# Altium project iF11L.PrjPcb
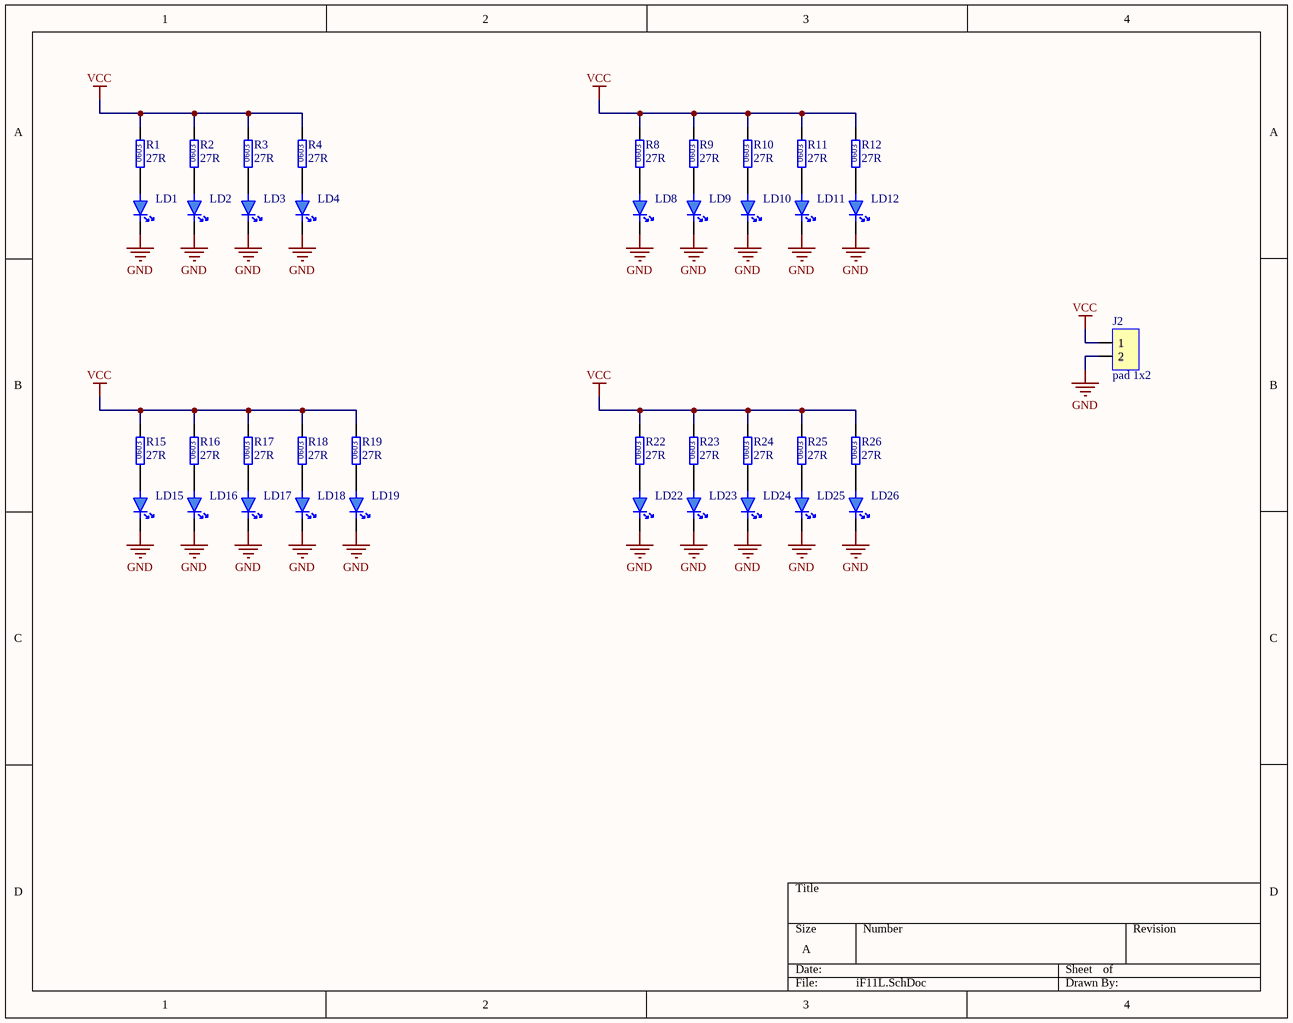
[diagram p0: iF11L.SchDoc]
1 sheet, 39 parts. Net scope: global (net labels, ports and power ports of the same name join across sheets).
Board file: iF11L.PcbDoc

## Sheet iF11L.SchDoc
size A; SheetNumber: 1; SheetTotal: 1

### Parts
J2  pad 1x2  [Pad-1x2]
LD1  HQ19-2101UWCE2 0603  [LED-0603-WS]  (value not drawn)
LD2  HQ19-2101UWCE2 0603  [LED-0603-WS]  (value not drawn)
LD3  HQ19-2101UWCE2 0603  [LED-0603-WS]  (value not drawn)
LD4  HQ19-2101UWCE2 0603  [LED-0603-WS]  (value not drawn)
LD8  HQ19-2101UWCE2 0603  [LED-0603-WS]  (value not drawn)
LD9  HQ19-2101UWCE2 0603  [LED-0603-WS]  (value not drawn)
LD10  HQ19-2101UWCE2 0603  [LED-0603-WS]  (value not drawn)
LD11  HQ19-2101UWCE2 0603  [LED-0603-WS]  (value not drawn)
LD12  HQ19-2101UWCE2 0603  [LED-0603-WS]  (value not drawn)
LD15  HQ19-2101UWCE2 0603  [LED-0603-WS]  (value not drawn)
LD16  HQ19-2101UWCE2 0603  [LED-0603-WS]  (value not drawn)
LD17  HQ19-2101UWCE2 0603  [LED-0603-WS]  (value not drawn)
LD18  HQ19-2101UWCE2 0603  [LED-0603-WS]  (value not drawn)
LD19  HQ19-2101UWCE2 0603  [LED-0603-WS]  (value not drawn)
LD22  HQ19-2101UWCE2 0603  [LED-0603-WS]  (value not drawn)
LD23  HQ19-2101UWCE2 0603  [LED-0603-WS]  (value not drawn)
LD24  HQ19-2101UWCE2 0603  [LED-0603-WS]  (value not drawn)
LD25  HQ19-2101UWCE2 0603  [LED-0603-WS]  (value not drawn)
LD26  HQ19-2101UWCE2 0603  [LED-0603-WS]  (value not drawn)
R1  27R  [R0603-LD]
R2  27R  [R0603-LD]
R3  27R  [R0603-LD]
R4  27R  [R0603-LD]
R8  27R  [R0603-LD]
R9  27R  [R0603-LD]
R10  27R  [R0603-LD]
R11  27R  [R0603-LD]
R12  27R  [R0603-LD]
R15  27R  [R0603-LD]
R16  27R  [R0603-LD]
R17  27R  [R0603-LD]
R18  27R  [R0603-LD]
R19  27R  [R0603-LD]
R22  27R  [R0603-LD]
R23  27R  [R0603-LD]
R24  27R  [R0603-LD]
R25  27R  [R0603-LD]
R26  27R  [R0603-LD]

### Nets
GND: J2.2 LD1.2(K) LD2.2(K) LD3.2(K) LD4.2(K) LD8.2(K) LD9.2(K) LD10.2(K) LD11.2(K) LD12.2(K) LD15.2(K) LD16.2(K) LD17.2(K) LD18.2(K) LD19.2(K) LD22.2(K) LD23.2(K) LD24.2(K) LD25.2(K) LD26.2(K)
VCC: J2.1 R1.2 R2.2 R3.2 R4.2 R8.2 R9.2 R10.2 R11.2 R12.2 R15.2 R16.2 R17.2 R18.2 R19.2 R22.2 R23.2 R24.2 R25.2 R26.2
NetLD1_1: LD1.1(A) R1.1
NetLD2_1: LD2.1(A) R2.1
NetLD3_1: LD3.1(A) R3.1
NetLD4_1: LD4.1(A) R4.1
NetLD8_1: LD8.1(A) R8.1
NetLD9_1: LD9.1(A) R9.1
NetLD10_1: LD10.1(A) R10.1
NetLD11_1: LD11.1(A) R11.1
NetLD12_1: LD12.1(A) R12.1
NetLD15_1: LD15.1(A) R15.1
NetLD16_1: LD16.1(A) R16.1
NetLD17_1: LD17.1(A) R17.1
NetLD18_1: LD18.1(A) R18.1
NetLD19_1: LD19.1(A) R19.1
NetLD22_1: LD22.1(A) R22.1
NetLD23_1: LD23.1(A) R23.1
NetLD24_1: LD24.1(A) R24.1
NetLD25_1: LD25.1(A) R25.1
NetLD26_1: LD26.1(A) R26.1

### Notes on the sheet
- (in symbol R 0603 27R) 0603

### Library data of the parts
J2 = Pad-1x2: 2 Pin SMD Pad
LD1-LD4 LD8-LD12 LD15-LD19 LD22-LD26 = LED WS: Supplier: 广州市亿毫安电子有限公司; WPCODE: *
R1-R4 R8-R12 R15-R19 R22-R26 = R 0603 27R: 5%; Part No: W-T-RE-RS03K270JT; Manufacturer: LAGEO; Material Name: 贴片电阻0603 27Ω 5%; Product Code: WP0002702; Supplier: 南京南山半导体有限公司